# Altium project pcb.PrjPcb
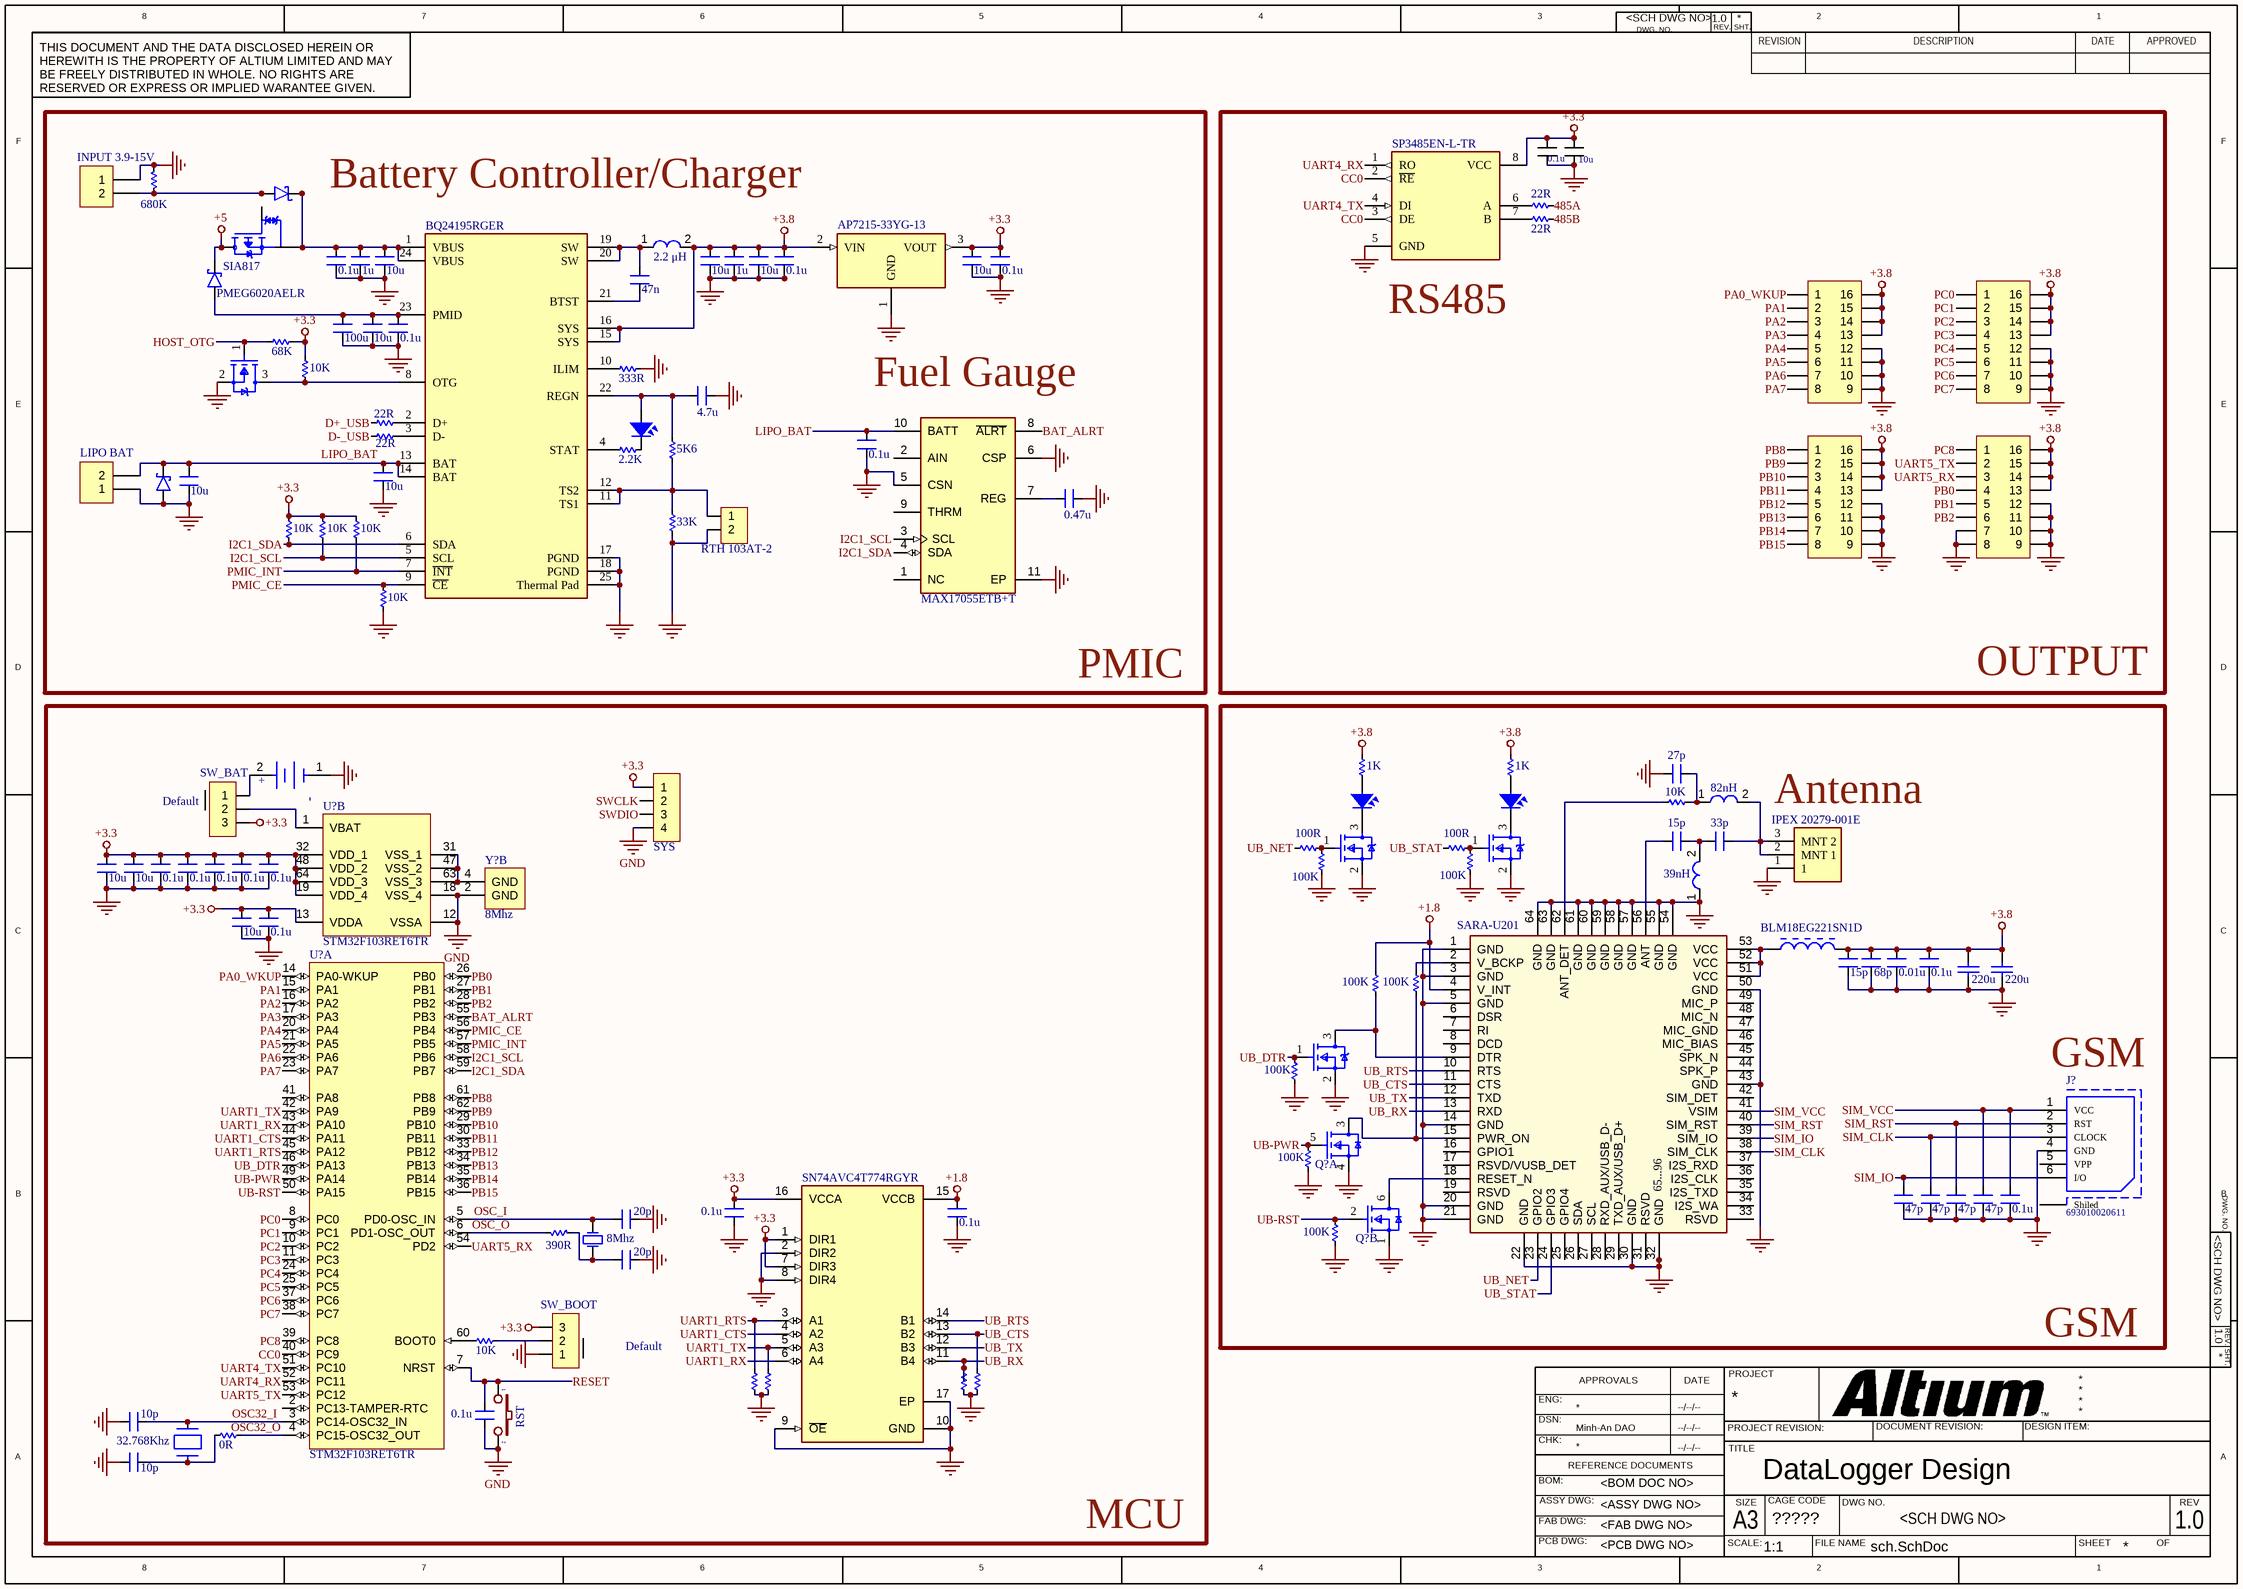
[diagram p0: sch.SchDoc]
CAGE_CODE: ?????; CONTRACT_NUMBER: <CONTRACT NO>; DOC_NO_ASSY_DWG: <ASSY DWG NO>; DOC_NO_BOM: <BOM DOC NO>; DOC_NO_FAB_DWG: <FAB DWG NO>; DOC_NO_SCH_DWG: <SCH DWG NO>; PCB_2_DEC_TOL: +/-.01; PCB_3_DEC_TOL: +/-.010; PCB_ANG_TOL: +/-1/2; PCB_ASSEMBLY_NO: <PCB ASSY NO>; PCB_CHECKER: - -----; PCB_CHECKER_APP_DATE: --/--/----; PCB_DESIGNER: - -----; PCB_DESIGNER_APP_DATE: --/--/----; PCB_DWG_NO: <PCB DWG NO>; PCB_ENGINEER: - -----; PCB_ENGINEER_APP_DATE: --/--/----; PCB_PART_NUMBER: <PCB PN>; PCB_REV: A; SCH_REV: A
1 sheet, 125 parts. Net scope: global (net labels, ports and power ports of the same name join across sheets).
Board file: pcb.PcbDoc

## Sheet sch.SchDoc: DataLogger Design
size 420 x 297 mm; Title2: hello; ENG_APP_DATE: --/--/--; DSN_APP_DATE: --/--/--; CHK_APP_DATE: --/--/--; Author: Minh-An DAO; DrawnBy: Minh-An DAO; Revision: 1.0; ItemRevision: 1.0; SCH_SCALE: 1:1

### Parts
(Parts that share a designator on the sheet are numbered #1, #2 ... from top to bottom, then left to right.)
BT?  BU2032SM-HD-G  [FP-BU2032SM-HD-G-MFG]  (value not drawn)
C?#1  0.1u  [CN-SMD-0805]
C?#2  10u  [CN-SMD-0805]
C?#3  JP8x2-2.0  [J8-C2T]  (value not drawn)
C?#4  JP8x2-2.0  [J8-C2T]  (value not drawn)
C?#5  JP8x2-2.0  [J8-C2T]  (value not drawn)
C?#6  JP8x2-2.0  [J8-C2T]  (value not drawn)
C?#7  RTH 103AT-2  [Header2]
C?#8  SW_BAT  [JP3-CLOSED]
C?#9  SYS  [JP4-D1T]
C?#10  220u  [C1206]
C?#11  220u  [C1206]
C?#12  SW_BOOT  [JP3-CLOSED]
C?#13  0.1u  [CN-SMD-0805]
Cx?#1  0.1u  [CN-SMD-0805]
Cx?#2  1u  [CN-SMD-0805]
Cx?#3  10u  [CN-SMD-0805]
Cx?#4  10u  [CN-SMD-0805]
Cx?#5  1u  [CN-SMD-0805]
Cx?#6  10u  [CN-SMD-0805]
Cx?#7  0.1u  [CN-SMD-0805]
Cx?#8  10u  [CN-SMD-0805]
Cx?#9  0.1u  [CN-SMD-0805]
Cx?#10  47n  [CN-SMD-0805]
Cx?#11  100u  [CN-SMD-0805]
Cx?#12  10u  [CN-SMD-0805]
Cx?#13  0.1u  [CN-SMD-0805]
Cx?#14  4.7u  [CN-SMD-0805]
Cx?#15  0.1u  [CN-SMD-0805]
Cx?#16  10u  [CN-SMD-0805]
Cx?#17  10u  [CN-SMD-0805]
Cx?#18  0.47u  [CN-SMD-0805]
Cx?#19  27p  [CN-SMD-0805]
Cx?#20  15p  [CN-SMD-0805]
Cx?#21  33p  [CN-SMD-0805]
Cx?#22  10u  [CN-SMD-0805]
Cx?#23  10u  [CN-SMD-0805]
Cx?#24  0.1u  [CN-SMD-0805]
Cx?#25  0.1u  [CN-SMD-0805]
Cx?#26  0.1u  [CN-SMD-0805]
Cx?#27  0.1u  [CN-SMD-0805]
Cx?#28  0.1u  [CN-SMD-0805]
Cx?#29  10u  [CN-SMD-0805]
Cx?#30  0.1u  [CN-SMD-0805]
Cx?#31  15p  [CN-SMD-0805]
Cx?#32  68p  [CN-SMD-0805]
Cx?#33  0.01u  [CN-SMD-0805]
Cx?#34  0.1u  [CN-SMD-0805]
Cx?#35  47p  [CN-SMD-0805]
Cx?#36  47p  [CN-SMD-0805]
Cx?#37  47p  [CN-SMD-0805]
Cx?#38  47p  [CN-SMD-0805]
Cx?#39  0.1u  [CN-SMD-0805]
Cx?#40  0.1u  [CN-SMD-0805]
Cx?#41  0.1u  [CN-SMD-0805]
Cx?#42  20p  [CN-SMD-0805]
Cx?#43  20p  [CN-SMD-0805]
Cx?#44  10p  [CN-SMD-0805]
Cx?#45  10p  [CN-SMD-0805]
D?#1  PMEG6020AELR  [CFP3-SOD123W-Nexperia]
D?#2  PMEG6020AELR  [CFP3-SOD123W-Nexperia]  (value not drawn)
FB?  BLM18EG221SN1D  [MURA-BLM18-RF-H4-CHIP-2_V]
J?#1  INPUT 3.9-15V  [KF2-3.5]
J?#2  LIPO BAT  [KF2-3.5]
J?#3  IPEX 20279-001E  [Taoglas_RECE.20279.001E.01_0]
J?#4  693010020611  [693010020611]
L?#1  2.2 μH  [L-SMD-M-7.3x4.5]
L?#2  82nH  [0603]
L?#3  39nH  [0603]
LED?#1  GREEN  [LED-0805-Green]  (value not drawn)
LED?#2  GREEN  [LED-0805-Green]  (value not drawn)
LED?#3  GREEN  [LED-0805-Green]  (value not drawn)
Q*?#1  SI2312BDS-T1-E3  [SI2312BDS-T1-E3_0]  (value not drawn)
Q*?#2  SI2312BDS-T1-E3  [SI2312BDS-T1-E3_0]  (value not drawn)
Q*?#3  SI2312BDS-T1-E3  [SI2312BDS-T1-E3_0]  (value not drawn)
Q*?#4  SI2312BDS-T1-E3  [SI2312BDS-T1-E3_0]  (value not drawn)
Q?#1  BSS138DWQ-7  [SOT363_IPC_A]  (value not drawn)  (part A of 2)
Q?#2  BSS138DWQ-7  [SOT363_IPC_A]  (value not drawn)  (part B of 2)
R?#1  680K  [RES-SMD-0805]
R?#2  22R  [RES-SMD-0805]
R?#3  22R  [RES-SMD-0805]
R?#4  68K  [RES-SMD-0805]
R?#5  10K  [RES-SMD-0805]
R?#6  333R  [RES-SMD-0805]
R?#7  22R  [RES-SMD-0805]
R?#8  22R  [RES-SMD-0805]
R?#9  2.2K  [RES-SMD-0805]
R?#10  5K6  [RES-SMD-0805]
R?#11  33K  [RES-SMD-0805]
R?#12  10K  [RES-SMD-0805]
R?#13  10K  [RES-SMD-0805]
R?#14  10K  [RES-SMD-0805]
R?#15  10K  [RES-SMD-0805]
R?#16  1K  [RES-SMD-0805]
R?#17  1K  [RES-SMD-0805]
R?#18  10K  [RES-SMD-0805]
R?#19  100R  [RES-SMD-0805]
R?#20  100R  [RES-SMD-0805]
R?#21  100K  [RES-SMD-0805]
R?#22  100K  [RES-SMD-0805]
R?#23  100K  [RES-SMD-0805]
R?#24  100K  [RES-SMD-0805]
R?#25  100K  [RES-SMD-0805]
R?#26  100K  [RES-SMD-0805]
R?#27  390R  [RES-SMD-0805]
R?#28  100K  [RES-SMD-0805]
R?#29  10K  [RES-SMD-0805]
R?#30  10K  [RES-SMD-0805]  (value not drawn)
R?#31  10K  [RES-SMD-0805]  (value not drawn)
R?#32  10K  [RES-SMD-0805]  (value not drawn)
R?#33  10K  [RES-SMD-0805]  (value not drawn)
R?#34  0R  [RES-SMD-0805]
RST  RST  [SW1-SMD]  (value not drawn)
U?#1  SP3485EN-L-TR  [MaxLinear_NSOIC8_IPC_C]
U?#2  BQ24195RGER  [BQ24195_RGE0024H_0]
U?#3  AP7215-33YG-13  [Diodes_SOT89_0]
U?#4  SIA817  [TRANS_SIA817EDJ-T1-GE3]
U?#5  MAX17055ETB+T  [FP-T102A2-1C-IPC_A]
U?#6  STM32F103RET6TR  [STM-LQFP64_M]  (part B of 2)
U?#7  SARA-U201  [SARA-XX]
U?#8  STM32F103RET6TR  [STM-LQFP64_M]  (part A of 2)
U?#9  SN74AVC4T774RGYR  [FP-RGY0016A-IPC_C]
Y?#1  8Mhz  [FOX-FQ5032B_V]  (part B of 2)
Y?#2  8Mhz  [FOX-FQ5032B_V]  (part A of 2)
Y?#3  32.768Khz  [FP-9HT10-MFG]

### Nets
+1.8: Cx?#41.2 R?#23.1 U?#7.4(V_INT) U?#9.15(VCCB)
+3.3: C?#1.1 C?#2.1 C?#8.3 C?#9.1 C?#12.3 Cx?#8.2 Cx?#9.2 Cx?#22.2 Cx?#23.2 Cx?#24.2 Cx?#25.2 Cx?#26.2 Cx?#27.2 Cx?#28.2 Cx?#29.2 Cx?#30.2 Cx?#40.2 R?#4.2 R?#5.1 R?#12.1 R?#13.1 R?#14.1 U?#1.8(VCC) U?#3.3(VOUT) U?#6.13(VDDA) U?#6.19(VDD_4) U?#6.32(VDD_1) U?#6.48(VDD_2) U?#6.64(VDD_3) U?#9.1(DIR1) U?#9.7(DIR3) U?#9.16(VCCA)
+3.8: C?#3.13 C?#3.14 C?#3.15 C?#3.16 C?#4.13 C?#4.14 C?#4.15 C?#4.16 C?#5.13 C?#5.14 C?#5.15 C?#5.16 C?#6.13 C?#6.14 C?#6.15 C?#6.16 C?#10.2 C?#11.2 Cx?#4.2 Cx?#5.2 Cx?#6.2 Cx?#7.2 Cx?#31.1 Cx?#32.1 Cx?#33.2 Cx?#34.2 FB?.2 L?#1.2 R?#16.1 R?#17.1 U?#2.15(SYS) U?#2.16(SYS) U?#3.2(VIN)
+5: D?#1.K U?#4.3(D) U?#4.8(D)
GND: BT?.1(C) C?#1.2 C?#2.2 C?#3.9 C?#3.10 C?#3.11 C?#3.12 C?#4.9 C?#4.10 C?#4.11 C?#4.12 C?#5.9 C?#5.10 C?#5.11 C?#5.12 C?#6.7 C?#6.8 C?#6.9 C?#6.10 C?#6.11 C?#6.12 C?#7.2 C?#9.4 C?#10.1 C?#11.1 C?#12.1 C?#13.2 Cx?#1.1 Cx?#2.1 Cx?#3.1 Cx?#4.1 Cx?#5.1 Cx?#6.1 Cx?#7.1 Cx?#8.1 Cx?#9.1 Cx?#11.1 Cx?#12.1 Cx?#13.1 Cx?#14.1 Cx?#15.1 Cx?#16.1 Cx?#17.1 Cx?#18.1 Cx?#19.2 Cx?#22.1 Cx?#23.1 Cx?#24.1 Cx?#25.1 Cx?#26.1 Cx?#27.1 Cx?#28.1 Cx?#29.1 Cx?#30.1 Cx?#31.2 Cx?#32.2 Cx?#33.1 Cx?#34.1 Cx?#35.2 Cx?#36.2 Cx?#37.2 Cx?#38.2 Cx?#39.1 Cx?#40.1 Cx?#41.1 Cx?#42.2 Cx?#43.2 Cx?#44.2 Cx?#45.2 D?#2.A J?#1.1 J?#2.1 J?#3.1 J?#4.4(GND) L?#3.1 Q*?#1.2(S) Q*?#2.2(S) Q*?#3.2(S) Q*?#4.2(S) Q?#1.4(S1) Q?#2.1(S2) R?#1.2 R?#6.2 R?#11.2 R?#15.2 R?#21.2 R?#22.2 R?#25.2 R?#26.2 R?#28.2 R?#30.2 R?#31.2 R?#32.2 R?#33.2 RST.2 U?#1.5(GND) U?#2.17(PGND) U?#2.18(PGND) U?#2.25(Thermal_Pad) U?#3.1(GND) U?#5.5(CSN) U?#5.6(CSP) U?#5.11(EP) U?#6.12(VSSA) U?#6.18(VSS_4) U?#7.1(GND) U?#7.3(GND) U?#7.5(GND) U?#7.14(GND) U?#7.20(GND) U?#7.21(GND) U?#7.22(GND) U?#7.30(GND) U?#7.32(GND) U?#7.43(GND) U?#7.50(GND) U?#7.54(GND) U?#7.55(GND) U?#7.57(GND) U?#7.58(GND) U?#7.59(GND) U?#7.60(GND) U?#7.61(GND) U?#7.63(GND) U?#7.64(GND) U?#7.65(GND) U?#7.66(GND) U?#7.67(GND) U?#7.68(GND) U?#7.69(GND) U?#7.70(GND) U?#7.71(GND) U?#7.72(GND) U?#7.73(GND) U?#7.74(GND) U?#7.75(GND) U?#7.76(GND) U?#7.77(GND) U?#7.78(GND) U?#7.79(GND) U?#7.80(GND) U?#7.81(GND) U?#7.82(GND) U?#7.83(GND) U?#7.84(GND) U?#7.85(GND) U?#7.86(GND) U?#7.87(GND) U?#7.88(GND) U?#7.89(GND) U?#7.90(GND) U?#7.91(GND) U?#7.92(GND) U?#7.93(GND) U?#7.94(GND) U?#7.95(GND) U?#7.96(GND) U?#9.2(DIR2) U?#9.8(DIR4) U?#9.9(~{OE}) U?#9.10(GND) U?#9.17(EP) Y?#1.2(GND)
485A: R?#2.2
485B: R?#3.2
BAT_ALRT: U?#5.8(~{ALRT}) U?#8.55(PB3)
CC0: U?#1.2(~{RE}) U?#1.3(DE) U?#8.40(PC9)
D+_USB: R?#7.1
D-_USB: R?#8.1
HOST_OTG: Q*?#1.1(G) R?#4.1
I2C1_SCL: R?#13.2 U?#2.5(SCL) U?#5.3(SCL) U?#8.58(PB6)
I2C1_SDA: R?#12.2 U?#2.6(SDA) U?#5.4(SDA) U?#8.59(PB7)
LIPO_BAT: Cx?#15.2 U?#5.10(BATT)
OSC32_I: Cx?#44.1 U?#8.3(PC14-OSC32_IN) Y?#3.2
OSC32_O: R?#34.2 U?#8.4(PC15-OSC32_OUT)
OSC_I: Cx?#42.1 U?#8.5(PD0-OSC_IN) Y?#2.3(X2)
OSC_O: R?#27.2 U?#8.6(PD1-OSC_OUT)
PA0_WKUP: C?#3.1 U?#8.14(PA0-WKUP)
PA1: C?#3.2 U?#8.15(PA1)
PA2: C?#3.3 U?#8.16(PA2)
PA3: C?#3.4 U?#8.17(PA3)
PA4: C?#3.5 U?#8.20(PA4)
PA5: C?#3.6 U?#8.21(PA5)
PA6: C?#3.7 U?#8.22(PA6)
PA7: C?#3.8 U?#8.23(PA7)
PB0: C?#6.4 U?#8.26(PB0)
PB1: C?#6.5 U?#8.27(PB1)
PB2: C?#6.6 U?#8.28(PB2)
PB8: C?#5.1 U?#8.61(PB8)
PB9: C?#5.2 U?#8.62(PB9)
PB10: C?#5.3 U?#8.29(PB10)
PB11: C?#5.4 U?#8.30(PB11)
PB12: C?#5.5 U?#8.33(PB12)
PB13: C?#5.6 U?#8.34(PB13)
PB14: C?#5.7 U?#8.35(PB14)
PB15: C?#5.8 U?#8.36(PB15)
PC0: C?#4.1 U?#8.8(PC0)
PC1: C?#4.2 U?#8.9(PC1)
PC2: C?#4.3 U?#8.10(PC2)
PC3: C?#4.4 U?#8.11(PC3)
PC4: C?#4.5 U?#8.24(PC4)
PC5: C?#4.6 U?#8.25(PC5)
PC6: C?#4.7 U?#8.37(PC6)
PC7: C?#4.8 U?#8.38(PC7)
PC8: C?#6.1 U?#8.39(PC8)
PMIC_CE: R?#15.1 U?#2.9(~{CE}) U?#8.56(PB4)
PMIC_INT: R?#14.2 U?#2.7(~{INT}) U?#8.57(PB5)
RESET: C?#13.1 RST.1 U?#8.7(NRST)
SIM_CLK: Cx?#36.1 J?#4.3(CLOCK) U?#7.38(SIM_CLK)
SIM_IO: Cx?#35.1 J?#4.6(I/O) U?#7.39(SIM_IO)
SIM_RST: Cx?#37.1 J?#4.2(RST) U?#7.40(SIM_RST)
SIM_VCC: Cx?#38.1 Cx?#39.2 J?#4.1(VCC) U?#7.41(VSIM)
SWCLK: C?#9.2
SWDIO: C?#9.3
UART1_CTS: U?#8.44(PA11) U?#9.4(A2)
UART1_RTS: R?#30.1 U?#8.45(PA12) U?#9.3(A1)
UART1_RX: U?#8.43(PA10) U?#9.6(A4)
UART1_TX: R?#31.1 U?#8.42(PA9) U?#9.5(A3)
UART4_RX: U?#1.1(RO) U?#8.52(PC11)
UART4_TX: U?#1.4(DI) U?#8.51(PC10)
UART5_RX: C?#6.3 U?#8.54(PD2)
UART5_TX: C?#6.2 U?#8.53(PC12)
UB-PWR: Q?#1.5(G1) R?#26.1 U?#8.49(PA14)
UB-RST: Q?#2.2(G2) R?#28.1 U?#8.50(PA15)
UB_CTS: R?#33.1 U?#7.11(CTS) U?#9.13(B2)
UB_DTR: Q*?#4.1(G) R?#25.1 U?#8.46(PA13)
UB_NET: R?#19.1 U?#7.23(GPIO2)
UB_RTS: U?#7.10(RTS) U?#9.14(B1)
UB_RX: R?#32.1 U?#7.13(RXD) U?#9.11(B4)
UB_STAT: R?#20.1 U?#7.24(GPIO3)
UB_TX: U?#7.12(TXD) U?#9.12(B3)
NetBT?_2: BT?.2(A) C?#8.1
NetC?#7_1: C?#7.1 R?#10.2 R?#11.1 U?#2.11(TS1) U?#2.12(TS2)
NetC?#8_2: C?#8.2 U?#6.1(VBAT)
NetC?#12_2: C?#12.2 R?#29.2
NetCx?#1_2: Cx?#1.2 Cx?#2.2 Cx?#3.2 U?#2.1(VBUS) U?#2.24(VBUS) U?#4.4(S) U?#4.6(K) U?#4.7(K)
NetCx?#10_1: Cx?#10.1 U?#2.21(BTST)
NetCx?#10_2: Cx?#10.2 L?#1.1 U?#2.19(SW) U?#2.20(SW)
NetCx?#11_2: Cx?#11.2 Cx?#12.2 Cx?#13.2 D?#1.A U?#2.23(PMID)
NetCx?#14_2: Cx?#14.2 LED?#1.1 R?#10.1 U?#2.22(REGN)
NetCx?#16_2: Cx?#16.2 Cx?#17.2 D?#2.K J?#2.2 U?#2.13(BAT) U?#2.14(BAT)
NetCx?#18_2: Cx?#18.2 U?#5.7(REG)
NetCx?#19_1: Cx?#19.1 L?#2.1 R?#18.2
NetCx?#20_1: Cx?#20.1 Cx?#21.2 L?#3.2
NetCx?#20_2: Cx?#20.2 U?#7.56(ANT)
NetCx?#21_1: Cx?#21.1 J?#3.2(MNT_1) J?#3.3(MNT_2) L?#2.2
NetCx?#43_1: Cx?#43.1 R?#27.1 Y?#2.1(X1)
NetCx?#45_1: Cx?#45.1 R?#34.1 Y?#3.1
NetFB?_1: FB?.1 U?#7.51(VCC) U?#7.52(VCC) U?#7.53(VCC)
NetJ?#1_2: J?#1.2 R?#1.1 U?#4.1(A)
NetLED?#1_2: LED?#1.2 R?#9.2
NetLED?#2_1: LED?#2.1 R?#16.2
NetLED?#2_2: LED?#2.2 Q*?#2.3(D)
NetLED?#3_1: LED?#3.1 R?#17.2
NetLED?#3_2: LED?#3.2 Q*?#3.3(D)
NetQ*?#1_3: Q*?#1.3(D) R?#5.2 U?#2.8(OTG)
NetQ*?#2_1: Q*?#2.1(G) R?#19.2 R?#21.1
NetQ*?#3_1: Q*?#3.1(G) R?#20.2 R?#22.1
NetQ*?#4_3: Q*?#4.3(D) R?#23.2 U?#7.9(DTR)
NetQ?#1_3: Q?#1.3(D1) R?#24.2 U?#7.15(PWR_ON)
NetQ?#2_6: Q?#2.6(D2) U?#7.18(RESET_N)
NetR?#2_1: R?#2.1 U?#1.6(A)
NetR?#3_1: R?#3.1 U?#1.7(B)
NetR?#6_1: R?#6.1 U?#2.10(ILIM)
NetR?#7_2: R?#7.2 U?#2.2(D+)
NetR?#8_2: R?#8.2 U?#2.3(D-)
NetR?#9_1: R?#9.1 U?#2.4(STAT)
NetR?#18_1: R?#18.1 U?#7.62(ANT_DET)
NetR?#24_1: R?#24.1 U?#7.2(V_BCKP)
NetR?#29_1: R?#29.1 U?#8.60(BOOT0)
NetU?#6_31: U?#6.31(VSS_1) U?#6.47(VSS_2) U?#6.63(VSS_3) Y?#1.4(GND)

Not connected (* = marked no-connect by the designer): J?#4 5(VPP) Shiled; U?#4 5(G); U?#5 1(NC) 2(AIN) 9(THRM); U?#7 6(DSR) 7(RI) 8(DCD) 16(GPIO1) 17(RSVD/VUSB_DET) 19(RSVD) 25(GPIO4) 26(SDA) 27(SCL) 28(RXD_AUX/USB_D-) 29(TXD_AUX/USB_D+) 31(RSVD) 33(RSVD) 34(I2S_WA) 35(I2S_TXD) 36(I2S_CLK) 37(I2S_RXD) 42(SIM_DET) 44(SPK_P) 45(SPK_N) 46(MIC_BIAS) 47(MIC_GND) 48(MIC_N) 49(MIC_P); U?#8 2(PC13-TAMPER-RTC) 41(PA8)

### Notes on the sheet
- (near U?#4) Battery Controller/Charger
- (near U?#1) RS485
- Fuel Gauge
- PMIC
- OUTPUT
- (near C?#8) Default
- Antenna
- (near J?#4) GSM
- GSM
- (near C?#12) Default
- MCU
- Labels drawn without touching a wire or pin: LIPO_BAT
- 8
- 7
- 6
- 5
- 4
- 3
- DWG. NO.
- REV.
- SHT.
- REVISION
- 2
- DESCRIPTION
- DATE
- 1
- APPROVED
- THIS DOCUMENT AND THE DATA DISCLOSED HEREIN OR HEREWITH IS THE PROPERTY OF ALTIUM LIMITED AND MAY BE FREELY DISTRIBUTED IN WHOLE. NO RIGHTS ARE RESERVED OR EXPRESS OR IMPLIED WARANTEE GIVEN.
- F
- E
- D
- C
- B
- ENG:
- APPROVALS
- PROJECT
- A
- DSN:
- CHK:
- REFERENCE DOCUMENTS
- PROJECT REVISION:
- TITLE
- DOCUMENT REVISION:
- DESIGN ITEM:
- BOM:
- FAB DWG:
- PCB DWG:
- ASSY DWG:
- SCALE:
- A3
- SIZE
- CAGE CODE
- FILE NAME
- DWG NO.
- SHEET
- OF
- REV
- (in symbol battery_holder_CMP-136216-000005-1) +; -
- (in symbol SARA-XX) 65...96

### Library data of the parts
BT? = battery_holder_CMP-136216-000005-1: BATTERY HOLDER COIN 20MM SMD; Number of Cells: 1; Termination: SMD/SMT; Min Operating Temperature: -40°C; Case/Package: SMD/SMT; Diameter: 20mm; Package Quantity: 1; Lead Free: Lead Free; Mount: Surface Mount; Packaging: Cut Tape; Max Operating Temperature: 280°C
C?#1 C?#2 = CAP
C?#3-C?#6 = JP8x2-2.0: WR-PHD 2.00 mm Dual Pin Header; Manufacturer: W¨¹rth Elektronik eiSos GmbH; partNo: 62001621121; ComponentLink1 Description: Manufacturer; ComponentLink2 Description: Datasheet; NoPins: 16; Created Date: 2 April 2013; ComponentLink1URL: http://www.we-online.com; ComponentLink2URL: http://katalog.we-online.de/em/datasheet/6200xx21121.pdf; Created by: Karrer Zheng
C?#7 = Header2: Header IDC, 2 x 1 Pin Vertical 2.54mm Pitch (Non-Boxed, Male); Manufacturer: W¨¹rth Elektronik eiSos GmbH; partNo: 613002143121; ComponentLink1 Description: Manufacturer; ComponentLink2 Description: Datasheet; NoPins: 02; Created Date: 29 March 2013; ComponentLink1URL: http://www.we-online.com; ComponentLink2URL: http://katalog.we-online.de/em/datasheet/6130xx143121.pdf; Created by: Karrer Zheng
C?#8 C?#12 = JP3: WR-PHD 2.54 mm Angled Socket Header; Manufacturer: W¨¹rth Elektronik eiSos GmbH; partNo: 613003143121; ComponentLink1 Description: Manufacturer; ComponentLink2 Description: Datasheet; NoPins: 03; Created Date: 29 March 2013; ComponentLink1URL: http://www.we-online.com; ComponentLink2URL: http://katalog.we-online.de/em/datasheet/6130xx143121.pdf; Created by: Karrer Zheng
C?#9 = JP4: WR-PHD 2.54 mm Angled Socket Header; Manufacturer: W¨¹rth Elektronik eiSos GmbH; partNo: 613004143121; ComponentLink1 Description: Manufacturer; ComponentLink2 Description: Datasheet; NoPins: 04; Created Date: 29 March 2013; ComponentLink1URL: http://www.we-online.com; ComponentLink2URL: http://katalog.we-online.de/em/datasheet/6130xx143121.pdf; Created by: Karrer Zheng
C?#10 C?#11 = Cap Semi: Capacitor (Semiconductor SIM Model); Value: 220uF; Published: 8-Jun-2000; LatestRevisionDate: 29-May-2009; LatestRevisionNote: IPC-7351 Footprint Added.; PackageReference: C1206; Publisher: Altium Limited; PackageDescription: Chip Capacitor
C?#13 Cx?#1-Cx?#45 = CN: Value: 33pF
D?#1 D?#2 = PMEG6020AELR: Diode, 60 V, 2 A low leakage current Schottky barrier rectifier
FB? = CMP-0686-00360-2: Chip Ferrite Bead for GHz Band General Use (Low DC Resistance Type), 220 Ohm, 2000 mA, -55 to 125 degC, 1.6 x 0.8 x 0.95 mm SMD, Tape and Reel; Manufacturer: Murata; Impedance (at 100 MHz): 220 Ohm +/- 25%; Rated Current: 2000 mA; DC Resistance: 0.05 Ohm Max.; Packing: Tape and Reel; PackageReference: BLM18_H950-2; PackageDescription: 2-Pin Chip, Body 1.6 x 0.8 mm; ComponentLink3Description: Package Specification; ComponentLink2Description: Datasheet; PartNumber: BLM18EG221SN1D; ComponentLink2URL: http://www.murata.com/products/catalog/pdf/c31e.pdf; Operating Temperature Range: -55 to 125 degC; ComponentLink1URL: http://www.murata.com/; ComponentLink1Description: Manufacturer URL; ComponentLink3URL: http://www.murata.com/products/catalog/pdf/c31e.pdf; Mounting Technology: Surface Mount; DatasheetVersion: 08/2013
J?#1 J?#2 = KF2: 3.9-17V; Manufacturer: Würth Elektronik eiSos GmbH; partNo: 691103110002; ComponentLink1 Description: Manufacturer; ComponentLink2 Description: Datasheet; NoPins: 2; Created Date: 29 October 2013; ComponentLink1URL: http://www.we-online.com; ComponentLink2URL: http://katalog.we-online.de/em/datasheet/6911031100xx.pdf; Created by: Karrer Zheng
J?#3 = RECE.20279.001E.01
J?#4 = sim_holder_693010020611_CMP-1502-00155-1: WR-CRD Mini SIM Card Connector Header Shielded; Manufacturer: Wurth Elektronik; Working Voltage: 50VAC; Rated Current: 0.5A; Withstanding Voltage: 500VAC; Packaging: TapeandReel; Manufacturer URL: http://www.we-online.de; Operating Temperature: -25to85degC; Publisher: WurthElektronik; Package Reference: 693010020611; Datasheet URL: https://katalog.we-online.de/em/datasheet/693010020611.pdf; Part Number: 693010020611; Mounting Technology: SMT
L?#1-L?#3 = L-SMD-1: partNo: 78477010; Manufacturer: Wurth Elektronik; ComponentLink1Description: Manufacturer; ComponentLink1URL: http://www.we-online.de; Created by: Baojun Chen; Created Date: Nov.2015; ComponentLink2Description: Datasheet; ComponentLink2URL: http://katalog.we-online.de/pbs/datasheet/78477010.pdf
  L?#1: Inductance: 2.2 μH
  L?#2: Inductance: 82nH
  L?#3: Inductance: 39nH
LED?#1-LED?#3 = LED SMD: Value: LED 3 - 5 ly 2 Colour
Q*?#1-Q*?#4 = SI2312BDS-T1-E3: N-Channel 20 V (D-S) MOSFET
R?#1-R?#34 = Res-SMD: Resistor; Manufacturer: Generic Components; Class: Passive; Published: 08/06/2000; Publisher: Altium Hobart Technology Centre
RST = SW2: Switch button 2 pin; Value: SW chip 2 pin
U?#2 = BQ24195RGER: bq24195 I2C Controlled 2.5-A /4.5-A Single Cell USB/Adapter Charger with 5.1 V at 1 A /5.1 V at 2.1 A Synchronous Boost Operation
U?#3 = AP7215-33YG-13: The AP7215 low-dropout linear regulator operates from a 3.3V to 5.5V supply and delivers a guaranteed 600mA continuous load current.
U?#4 = SIA817EDJ-T1-GE3: P-Channel 30V 4.5A (Tc) 1.9W (Ta), 6.5W (Tc) Surface Mount
U?#5 = MAX17055ETB+T_CMP-05715-000065-1: IC FUEL GAUGE MODELGAUGE 10TDFN; Manufacturer: Maxim Integrated; Nominal Supply Current: 18uA; Standoff Height: 0mm; Max Supply Voltage: 4.9V; Min Supply Voltage: 2.3V; Number Of Cells: 1; Temperature: -40°C to +85°C; Octopart: https://octopart.com/max17055etb%2Bt-maxim+integrated-76519097; ComponentLink2URL: https://datasheets.maximintegrated.com/en/ds/MAX17055.pdf; Footprint Url: https://pdfserv.maximintegrated.com/land_patterns/90-100007.PDF; Digikey Description: IC FUEL GAUGE MODELGAUGE 10TDFN; RoHS: TRUE; Device Class L1: Integrated Circuits (ICs); Package: T102A2-1C; Ipc Land Pattern Name: DFN200X250X75-10; Temperature Range Low: -40°C; Height: 0.8mm; Manufacturer Part Number: MAX17055ETB+T; Automotive: No; Device Class L3: Battery Management; Device Class L2: Power Management ICs; ComponentLink2Description: Datasheet; Category: IC; Temperature Range High: +85°C; Lead Free: Yes
U?#6 U?#8 = STM32F103RET6TR_CMP-0237-00200-3: ARM Cortex-M3 32-bit MCU, 512 KB Flash, 64 KB Internal RAM, 51 I/Os, 64-pin LQFP, -40 to 85 degC, Tape and Reel; A/D Converter: 3x12-bit (16 Channel); I/Os (High Current): 51; Internal RAM Size (kB): 64; Operating Frequency(F) (Processor speed) (MHz): 72; D/A Converter: 2x12-bit (2 Channel); FLASH Size (Prog) (kB): 512; Supply Voltage(Vcc) min (V): 2; ComponentLink3URL: http://www.st.com/st-web-ui/static/active/en/resource/technical/document/datasheet/DM00037051.pdf; PackageReference: LQFP64; Core: ARM Cortex-M3; DatasheetVersion: Rev. 8; ComponentLink1Description: Manufacturer URL; Mounting Technology: Surface Mount; ComponentLink1URL: http://www.st.com/web/en/home.html; PackageDescription: 64-Pin Low Profile Quad Flat Package, 10 x 10 mm Body, 0.5 mm Pitch; ComponentLink2Description: Datasheet; PartNumber: STM32F103RET6TR; ComponentLink3Description: Package Specification; PackageVersion: Rev. 4, 06/2013; ComponentLink2URL: http://www.st.com/st-web-ui/static/active/en/resource/technical/document/datasheet/CD00191185.pdf; Packing: Tape and Reel
U?#7 = SARA-XX: GSM/GPRS and GSM/EGPRS/HSPA Cellular Module; Manufacturer: u-blox; Part Description: GSM/EGPRS/HSPA module; Value: SARA-XX
U?#9 = SN74AVC4T774RGYR_CMP-04899-000023-1: IC TRNSLTR BIDIRECTIONAL 16VQFN; Manufacturer: Texas Instruments; V A Max: 3.6V; Number Of Inputs: 4; Min Supply Voltage: 1.2V; Nominal Supply Current: 16uA; Data Rate: 380Mbits/s; Propagation Delay: 2.6ns; Number Of Circuits: 1; Standoff Height: 0mm; Logic Function Desc: Non-Inverting; Temperature: -40°C to +85°C; Max Supply Voltage: 3.6V; Temperature Range High: +85°C; Octopart: https://octopart.com/sn74avc4t774rgyr-texas+instruments-12195083; Device Class L1: Integrated Circuits (ICs); Ambient Temperature Range Low: -40°C; ComponentLink2Description: Datasheet; Ambient Temperature Range High: +85°C; V A Min: 1.2V; Number Of Outputs: 4; Manufacturer Part Number: SN74AVC4T774RGYR; Ipc Land Pattern Name: QFN50P350X400X90-16; Digikey Description: IC TRNSLTR BIDIRECTIONAL 16VQFN; Device Class L3: Voltage Level Shifters; Device Class L2: Logic ICs; Lead Free: Yes; Package: RGY0016A; ComponentLink2URL: http://www.ti.com/lit/ds/symlink/sn74avc4t774.pdf; Height: 1mm; V B Min: 1.2V; RoHS: TRUE; V B Max: 3.6V; Temperature Range Low: -40°C; Mouser Description: Translation - Voltage Levels 4B Dual-Supply Bus Xcvr; Category: IC; Automotive: No
Y?#1 Y?#2 = crystal_5032_CMP-0399-00003-1: FQ5032B-24, Crystal Oscillator, SMD, 24MHz, Stab=30ppm 20.0pF; Manufacturer: FOX Electronics; Frequency Tolerance: 30 ppm; Mounting Technology: Surface Mount; Nominal Frequency: 24 MHz; ComponentLink2Description: Datasheet; ComponentLink1Description: Manufacturer URL; ComponentLink2URL: http://www.foxonline.com/pdfs/fq5032.pdf; PackageDescription: 4-Pin SMT Crystal, 5.2 x 3.4 mm Body; DatasheetVersion: Mar-10; ComponentLink1URL: http://www.foxonline.com/; PartNumber: FQ5032B-24; Storage Temperature: -40 to 85 degC; PackageReference: FQ5032B
Y?#3 = crystal_3215_CMP-18717-000007-1: 9HT10-32.768KDZY-T, CRYSTAL 32.7680KHZ 7PF SMD; Tolerance: 20ppm; ESR (Equivalent Series Resistance): 70kR; Case/Package: SMD/SMT; Frequency: 32.768kHz; Load Capacitance: 7pF; Mount: Surface Mount; Package Quantity: 1; REACH SVHC: No SVHC; Packaging: Tape and Reel; Number of Pins: 2; Termination: SMD/SMT; Length: 0.126inch; Width: 1.5mm; Height: 0.033inch; Max Operating Temperature: 85°C; Lead Free: Lead Free; Min Operating Temperature: -40°C; Frequency Tolerance: 20ppm